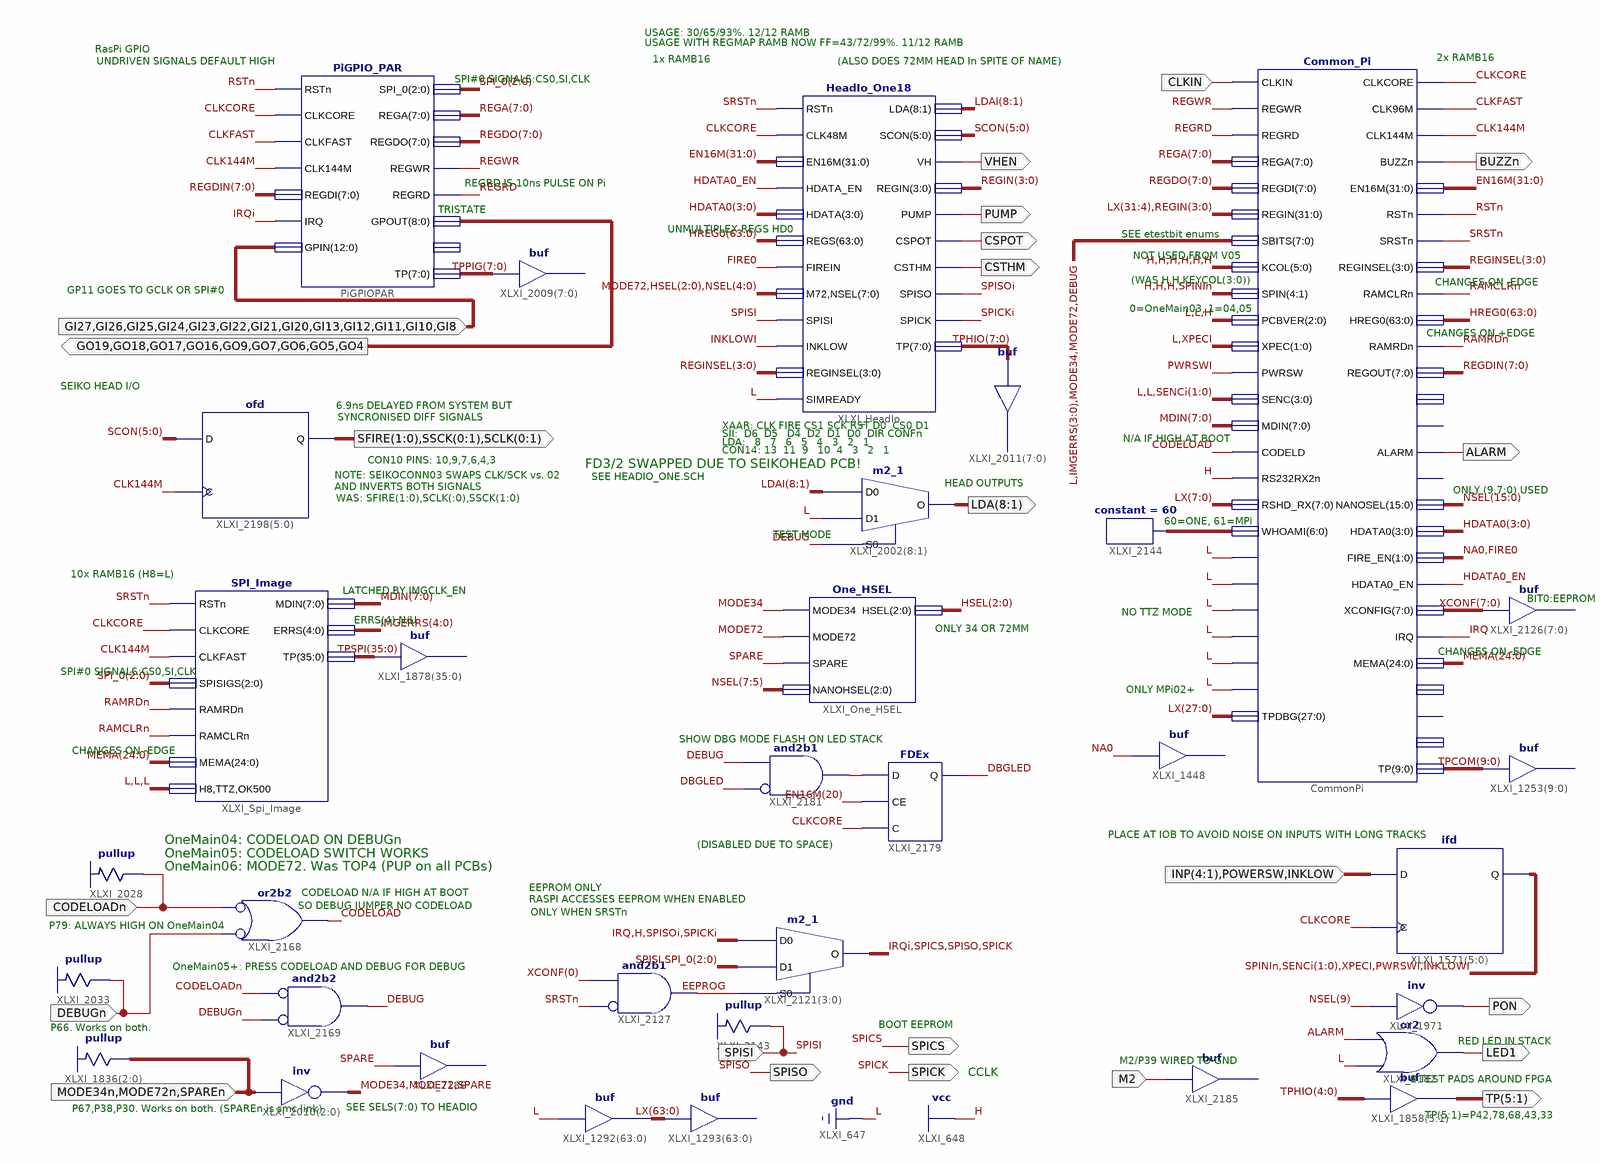
[diagram p0: schematic sheet 1]
// Xilinx ISE schematic OnePi_04.sch (spartan3e) as structural Verilog: 33 symbols, 23 ports
module OnePi_04 (
  input  GI27,
  input  GI26,
  input  GI25,
  input  GI24,
  input  GI23,
  input  GI22,
  input  GI21,
  input  GI20,
  input  GI13,
  input  GI12,
  input  GI11,
  input  GI10,
  input  GI8,
  input  DEBUGn,
  input  CODELOADn,
  input  CLKIN,
  input  M2,
  input  MODE34n,
  input  MODE72n,
  input  SPAREn,
  input  SPISI,
  input  [4:1] INP,
  input  POWERSW,
  input  INKLOW,
  output ALARM,
  output GO19,
  output GO18,
  output GO17,
  output GO16,
  output GO9,
  output GO7,
  output GO6,
  output GO5,
  output GO4,
  output [5:1] TP,
  output BUZZn,
  output SPICK,
  output SPICS,
  output SPISO,
  output [8:1] LDA,
  output [1:0] SFIRE,
  output [1:0] SSCK,
  output [1:0] SCLK,
  output LED1,
  output PON,
  output PUMP,
  output VHEN,
  output CSPOT,
  output CSTHM
);

  wire CLK144M, CLKCORE, CLKFAST, CODELOAD, DBGLED, DEBUG, EEPROG, FIRE0, HDATA0_EN, INKLOWI, IRQ, IRQi,
       MODE34, MODE72, NA0, PWRSWI, RAMCLRn, RAMRDn, REGRD, REGWR, RSTn, SPARE, SPICKi, SPINIn, SPISOi,
       SRSTn, XLXN_56, XPECI;
  wire [1:0] SENCi;
  wire [2:0] HSEL, SPI_0;
  wire [3:0] HDATA0, REGIN, REGINSEL;
  wire [4:0] IMGERRS;
  wire [5:0] SCON;
  wire [6:0] XLXN_1;
  wire [7:0] MDIN, REGA, REGDIN, REGDO, TPHIO, TPPIG, XCONF;
  wire [8:1] LDAI;
  wire [9:0] TPCOM;
  wire [15:0] NSEL;
  wire [24:0] MEMA;
  wire [31:0] EN16M;
  wire [35:0] TPSPI;
  wire [63:0] HREG0, LX;

  \pullup  XLXI_2033 (.O(DEBUGn));
  \pullup  XLXI_2028 (.O(CODELOADn));
  // buf XLXI_2009[7..0] has open pins: I=TPPIG, O=open
  assign LX = {64{1'b0}};  // buf XLXI_1292[63..0], 64 bits wide
  // buf XLXI_1293[63..0] has open pins: I=LX, O=open
  assign TP = TPHIO[4:0];  // buf XLXI_1858[5..1], 5 bits wide
  or XLXI_2168 (CODELOAD, ~DEBUGn, ~CODELOADn);  // or2b2
  constant #(.CValue("60")) XLXI_2144 (.O(XLXN_1));
  // buf XLXI_2126[7..0] has open pins: I=XCONF, O=open
  and XLXI_2169 (DEBUG, ~DEBUGn, ~CODELOADn);  // and2b2
  // buf XLXI_2185 has open pins: I=M2, O=open
  m2_1 XLXI_2121[3:0] (
    .D0({IRQ, 1'b1, SPISOi, SPICKi}), .D1({SPISI, SPI_0}), .S0(EEPROG), .O({IRQi, SPICS, SPISO, SPICK}));
  and XLXI_2127 (EEPROG, ~SRSTn, XCONF[0]);  // and2b1
  \pullup  XLXI_2143 (.O(SPISI));
  assign {MODE34, MODE72, SPARE} = ~{MODE34n, MODE72n, SPAREn};  // inv XLXI_2010[2..0], 3 bits wide
  \pullup  XLXI_1836[2:0] (.O({MODE34n, MODE72n, SPAREn}));
  // buf XLXI_2186 has open pins: I=SPARE, O=open
  m2_1 XLXI_2002[8:1] (.D0(LDAI), .D1(1'b0), .S0(DEBUG), .O(LDA));
  One_HSEL XLXI_One_HSEL (.HSEL(HSEL), .MODE34(MODE34), .MODE72(MODE72), .NANOHSEL(NSEL[7:5]), .SPARE(SPARE));
  and XLXI_2181 (XLXN_56, ~DBGLED, DEBUG);  // and2b1
  FDEx XLXI_2179 (.C(CLKCORE), .CE(EN16M[20]), .D(XLXN_56), .Q(DBGLED));
  ofd XLXI_2198[5:0] (.C(CLK144M), .D(SCON), .Q({SFIRE, SSCK[0], SSCK[1], SCLK[0], SCLK[1]}));
  or XLXI_2182 (LED1, 1'b0, ALARM);
  not XLXI_1971 (PON, NSEL[9]);
  ifd XLXI_1571[5:0] (.C(CLKCORE), .D({INP, POWERSW, INKLOW}), .Q({SPINIn, SENCi, XPECI, PWRSWI, INKLOWI}));
  // buf XLXI_1253[9..0] has open pins: I=TPCOM, O=open
  // buf XLXI_1448 has open pins: I=NA0, O=open
  Common_Pi CommonPi (
    .ALARM(ALARM), .BUZZn(BUZZn), .CLK144M(CLK144M), .CLK96M(CLKFAST), .CLKCORE(CLKCORE), .CLKIN(CLKIN),
    .CODELD(CODELOAD), .EN16M(EN16M), .FIRE_EN({NA0, FIRE0}), .HDATA0(HDATA0), .HDATA0_EN(HDATA0_EN),
    .HREG0(HREG0), .IRQ(IRQ), .ISCLK48M(1'b0), .KCOL({6{1'b1}}), .MASTERPI(1'b0), .MDIN(MDIN), .MEMA(MEMA),
    .NANOSEL(NSEL), .OK_500(1'b0), .OK_RASOFF(1'b0), .OK_RS232(1'b0), .OK_RSHEAD(1'b0), .PCBVER(3'b001),
    .PWRSW(PWRSWI), .RAMCLRn(RAMCLRn), .RAMRDn(RAMRDn), .REGA(REGA), .REGDI(REGDO),
    .REGIN({LX[31:4], REGIN}), .REGINSEL(REGINSEL), .REGOUT(REGDIN), .REGRD(REGRD), .REGWR(REGWR),
    .RS232RX2n(1'b1), .RSHD_RX(LX[7:0]), .RSTn(RSTn), .SENC({2'b00, SENCi}), .SPIN({3'b111, SPINIn}),
    .SRSTn(SRSTn), .TP(TPCOM), .SBITS({1'b0, IMGERRS[3:0], MODE34, MODE72, DEBUG}), .WHOAMI(XLXN_1),
    .XCONFIG(XCONF), .XPEC({1'b0, XPECI}), .TPDBG(LX[27:0]));  // open: KROW, READY, RS232TX2n, SPOUT, TTZMODE, H8MODE, TX
  // buf XLXI_2011[7..0] has open pins: I=TPHIO, O=open
  HeadIo_One18 XLXI_HeadIo (
    .CLK48M(CLKCORE), .CSPOT(CSPOT), .CSTHM(CSTHM), .EN16M(EN16M), .FIREIN(FIRE0), .HDATA(HDATA0),
    .HDATA_EN(HDATA0_EN), .INKLOW(INKLOWI), .LDA(LDAI), .M72(MODE72), .NSEL({HSEL, NSEL[4:0]}), .PUMP(PUMP),
    .REGIN(REGIN), .REGINSEL(REGINSEL), .REGS(HREG0), .RSTn(SRSTn), .SCON(SCON), .SIMREADY(1'b0),
    .SPICK(SPICKi), .SPISI(SPISI), .SPISO(SPISOi), .TP(TPHIO), .VH(VHEN));
  SPI_Image XLXI_Spi_Image (
    .CLKCORE(CLKCORE), .CLKFAST(CLK144M), .ERRS(IMGERRS), .H8(1'b0), .TTZ(1'b0), .OK500(1'b0), .MDIN(MDIN),
    .MEMA(MEMA), .RAMCLRn(RAMCLRn), .RAMRDn(RAMRDn), .RSTn(SRSTn), .SPISIGS(SPI_0), .TP(TPSPI));
  // buf XLXI_1878[35..0] has open pins: I=TPSPI, O=open
  PiGPIO_PAR PiGPIOPAR (
    .CLK144M(CLK144M), .CLKCORE(CLKCORE), .CLKFAST(CLKFAST),
    .GPIN({GI27, GI26, GI25, GI24, GI23, GI22, GI21, GI20, GI13, GI12, GI11, GI10, GI8}),
    .GPOUT({GO19, GO18, GO17, GO16, GO9, GO7, GO6, GO5, GO4}), .IRQ(IRQi), .REGA(REGA), .REGDI(REGDIN),
    .REGDO(REGDO), .REGRD(REGRD), .REGWR(REGWR), .RSTn(RSTn), .SPI_0(SPI_0), .TP(TPPIG));  // open: LASTWR

  // Notes on the sheet:
  //   USAGE: 30/65/93%. 12/12 RAMB
  //   USAGE WITH REGMAP RAMB NOW FF=43/72/99%. 11/12 RAMB
  //   RasPi GPIO
  //   2x RAMB16
  //   1x RAMB16
  //   UNDRIVEN SIGNALS DEFAULT HIGH
  //   (ALSO DOES 72MM HEAD In SPITE OF NAME)
  //   SPI#0 SIGNALS:CS0,SI,CLK
  //   REGRD IS 10ns PULSE ON Pi
  //   TRISTATE
  //   UNMULTIPLEX REGS HD0
  //   SEE etestbit enums
  //   NOT USED FROM V05
  //   (WAS H,H,KEYCOL(3:0))
  //   CHANGES ON -EDGE
  //   GP11 GOES TO GCLK OR SPI#0
  //   0=OneMain03, 1=04,05
  //   CHANGES ON +EDGE
  //   SEIKO HEAD I/O
  //   6.9ns DELAYED FROM SYSTEM BUT
  //   SYNCRONISED DIFF SIGNALS
  //   XAAR: CLK FIRE CS1 SCK RST D0  CS0 D1
  //   SII:  D6  D5   D4  D2  D1  D0  DIR CONFn
  //   N/A IF HIGH AT BOOT
  //   LDA:   8   7   6   5   4   3   2   1
  //   CON14: 13  11  9   10  4   3   2   1
  //   CON10 PINS: 10,9,7,6,4,3
  //   FD3/2 SWAPPED DUE TO SEIKOHEAD PCB!
  //   NOTE: SEIKOCONN03 SWAPS CLK/SCK vs. 02
  //   SEE HEADIO_ONE.SCH
  //   HEAD OUTPUTS
  //   AND INVERTS BOTH SIGNALS
  //   ONLY (9,7:0) USED
  //   WAS: SFIRE(1:0),SCLK(:0),SSCK(1:0)
  //   60=ONE, 61=MPi
  //   TEST MODE
  //   10x RAMB16 (H8=L)
  //   LATCHED BY IMGCLK_EN
  //   BIT0:EEPROM
  //   NO TTZ MODE
  //   ERRS(4) N/U
  //   ONLY 34 OR 72MM
  //   CHANGES ON -EDGE
  //   SPI#0 SIGNALS:CS0,SI,CLK
  //   ONLY MPi02+
  //   SHOW DBG MODE FLASH ON LED STACK
  //   CHANGES ON -EDGE
  //   PLACE AT IOB TO AVOID NOISE ON INPUTS WITH LONG TRACKS
  //   OneMain04: CODELOAD ON DEBUGn
  //   (DISABLED DUE TO SPACE)
  //   OneMain05: CODELOAD SWITCH WORKS
  //   OneMain06: MODE72. Was TOP4 (PUP on all PCBs)
  //   EEPROM ONLY
  //   CODELOAD N/A IF HIGH AT BOOT
  //   RASPI ACCESSES EEPROM WHEN ENABLED
  //   SO DEBUG JUMPER NO CODELOAD
  //   ONLY WHEN SRSTn
  //   P79: ALWAYS HIGH ON OneMain04
  //   OneMain05+: PRESS CODELOAD AND DEBUG FOR DEBUG
  //   BOOT EEPROM
  //   P66. Works on both.
  //   RED LED IN STACK
  //   M2/P39 WIRED TO GND
  //   CCLK
  //   6 TEST PADS AROUND FPGA
  //   SEE SELS(7:0) TO HEADIO
  //   P67,P38,P30. Works on both. (SPAREn is smc link)
  //   TP(5:1)=P42,78,68,43,33
endmodule
